# Altium schematic sheet MC1.SchDoc: XEM7360 Breakout Board - MC1
size C; Author: Nick Kettman; Organization: Opal Kelly; Address1: 13500 SW 72nd Ave Ste 100; Address2: Portland, OR 97223; Address4: http://www.opalkelly.com; DocumentNumber: xxx; Revision: 1; SheetNumber: 2; SheetTotal: 3; PageSetup: Record=PageOptions|CenterHorizontal=True|CenterVertical=True|PrintScale=0.53|XCorrection=1.00|YCorrection=1.00|PrintKind=0|BorderSize=5000000|LeftOffset=0|BottomOffset=0|Orientation=2|PaperLength=1000|PaperWidth=1000|Scale=100|PaperSource=7|PrintQuality=-4|MediaType=1|DitherType=10|PaperKind=Letter|PrintScaleMode=1
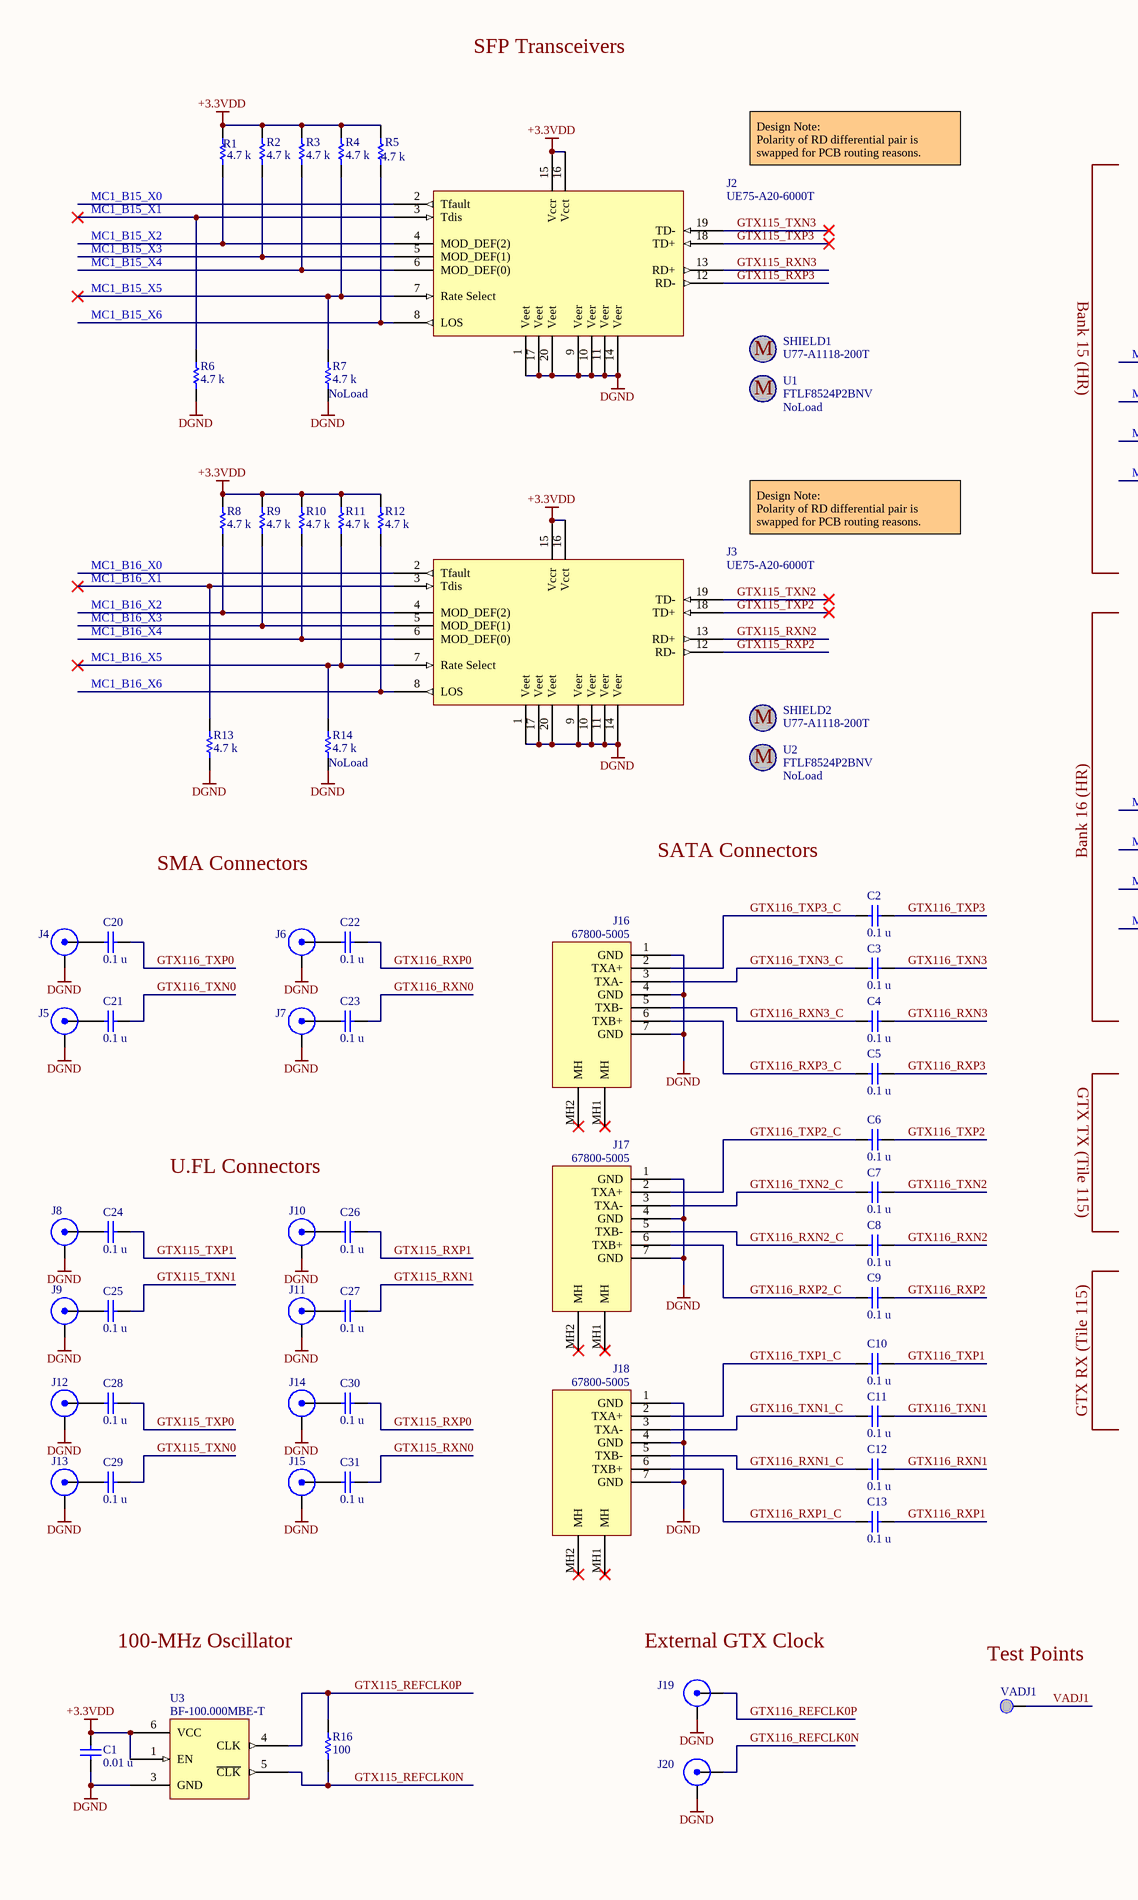
[diagram p0: MC1.SchDoc, left]
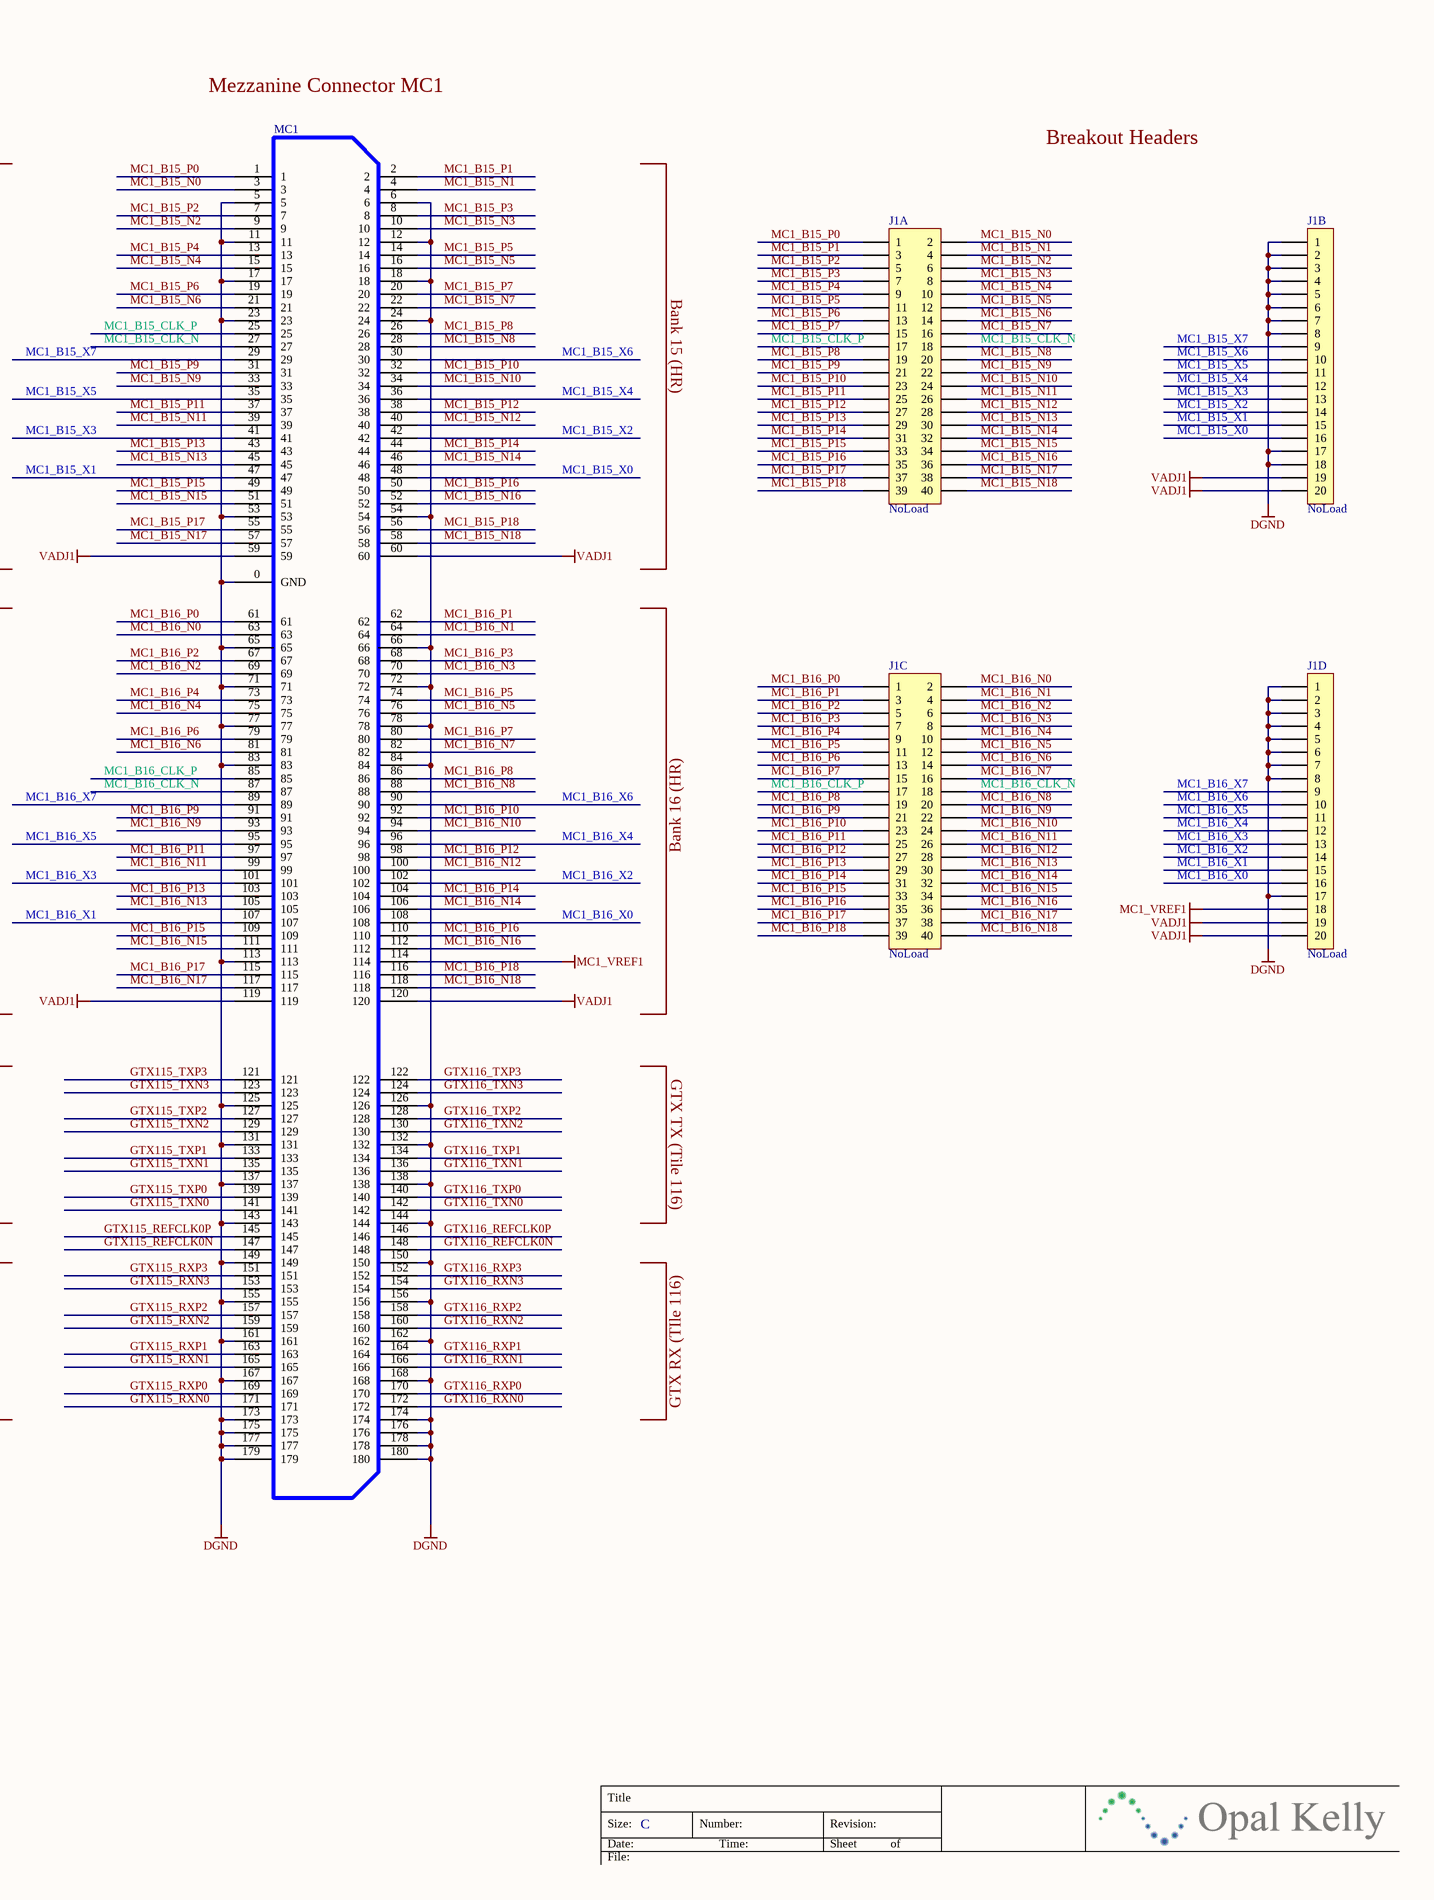
[diagram p1: MC1.SchDoc, right]

## Parts
C1  value 0.01 u  [CAPC1005N]  (hidden comment: C0402C103K4RACTU)
C2  value 0.1 u  [CAPC1005N]  (hidden comment: C0402C104K8PACTU)
C3  value 0.1 u  [CAPC1005N]  (hidden comment: C0402C104K8PACTU)
C4  value 0.1 u  [CAPC1005N]  (hidden comment: C0402C104K8PACTU)
C5  value 0.1 u  [CAPC1005N]  (hidden comment: C0402C104K8PACTU)
C6  value 0.1 u  [CAPC1005N]  (hidden comment: C0402C104K8PACTU)
C7  value 0.1 u  [CAPC1005N]  (hidden comment: C0402C104K8PACTU)
C8  value 0.1 u  [CAPC1005N]  (hidden comment: C0402C104K8PACTU)
C9  value 0.1 u  [CAPC1005N]  (hidden comment: C0402C104K8PACTU)
C10  value 0.1 u  [CAPC1005N]  (hidden comment: C0402C104K8PACTU)
C11  value 0.1 u  [CAPC1005N]  (hidden comment: C0402C104K8PACTU)
C12  value 0.1 u  [CAPC1005N]  (hidden comment: C0402C104K8PACTU)
C13  value 0.1 u  [CAPC1005N]  (hidden comment: C0402C104K8PACTU)
C20  value 0.1 u  [CAPC1005N]  (hidden comment: C0402C104K8PACTU)
C21  value 0.1 u  [CAPC1005N]  (hidden comment: C0402C104K8PACTU)
C22  value 0.1 u  [CAPC1005N]  (hidden comment: C0402C104K8PACTU)
C23  value 0.1 u  [CAPC1005N]  (hidden comment: C0402C104K8PACTU)
C24  value 0.1 u  [CAPC1005N]  (hidden comment: C0402C104K8PACTU)
C25  value 0.1 u  [CAPC1005N]  (hidden comment: C0402C104K8PACTU)
C26  value 0.1 u  [CAPC1005N]  (hidden comment: C0402C104K8PACTU)
C27  value 0.1 u  [CAPC1005N]  (hidden comment: C0402C104K8PACTU)
C28  value 0.1 u  [CAPC1005N]  (hidden comment: C0402C104K8PACTU)
C29  value 0.1 u  [CAPC1005N]  (hidden comment: C0402C104K8PACTU)
C30  value 0.1 u  [CAPC1005N]  (hidden comment: C0402C104K8PACTU)
C31  value 0.1 u  [CAPC1005N]  (hidden comment: C0402C104K8PACTU)
J1A  0877584016  [HDR2X20-2MM]  (value not drawn)
J1B  Header, 20-Pin, Single Row  [HDR1X20-2MM]  (value not drawn)
J1C  0877584016  [HDR2X20-2MM]  (value not drawn)
J1D  Header, 20-Pin, Single Row  [HDR1X20-2MM]  (value not drawn)
J2  UE75-A20-6000T  [SFP_RCPT_20_CAGE]
J3  UE75-A20-6000T  [SFP_RCPT_20_CAGE]
J4  TXP0  [SMA]  (value not drawn)
J5  TXN0  [SMA]  (value not drawn)
J6  RXP0  [SMA]  (value not drawn)
J7  RXN0  [SMA]  (value not drawn)
J8  TXP1  [UFL-R-SMT-1]  (value not drawn)
J9  TXN1  [UFL-R-SMT-1]  (value not drawn)
J10  RXP1  [UFL-R-SMT-1]  (value not drawn)
J11  RXN1  [UFL-R-SMT-1]  (value not drawn)
J12  TXP0  [UFL-R-SMT-1]  (value not drawn)
J13  TXN0  [UFL-R-SMT-1]  (value not drawn)
J14  RXP0  [UFL-R-SMT-1]  (value not drawn)
J15  RXN0  [UFL-R-SMT-1]  (value not drawn)
J16  67800-5005  [MOLEX-67800-5005]
J17  67800-5005  [MOLEX-67800-5005]
J18  67800-5005  [MOLEX-67800-5005]
J19  901-144-8RFX  [SMA]  (value not drawn)
J20  901-144-8RFX  [SMA]  (value not drawn)
MC1  QTH-090-01-F-D-A  [QTH-090-01-X-D]  (value not drawn)
R1  value 4.7 k  [RESC1005N]  (hidden comment: CRCW04024K70JNED)
R2  value 4.7 k  [RESC1005N]  (hidden comment: CRCW04024K70JNED)
R3  value 4.7 k  [RESC1005N]  (hidden comment: CRCW04024K70JNED)
R4  value 4.7 k  [RESC1005N]  (hidden comment: CRCW04024K70JNED)
R5  value 4.7 k  [RESC1005N]  (hidden comment: CRCW04024K70JNED)
R6  value 4.7 k  [RESC1005N]  (hidden comment: CRCW04024K70JNED)
R7  value 4.7 k  [RESC1005N]  (hidden comment: CRCW04024K70JNED)
R8  value 4.7 k  [RESC1005N]  (hidden comment: CRCW04024K70JNED)
R9  value 4.7 k  [RESC1005N]  (hidden comment: CRCW04024K70JNED)
R10  value 4.7 k  [RESC1005N]  (hidden comment: CRCW04024K70JNED)
R11  value 4.7 k  [RESC1005N]  (hidden comment: CRCW04024K70JNED)
R12  value 4.7 k  [RESC1005N]  (hidden comment: CRCW04024K70JNED)
R13  value 4.7 k  [RESC1005N]  (hidden comment: CRCW04024K70JNED)
R14  value 4.7 k  [RESC1005N]  (hidden comment: CRCW04024K70JNED)
R16  value 100  [RESC1608N]  (hidden comment: CRCW0603100RFKEA)
SHIELD1  U77-A1118-200T  (mechanical)
SHIELD2  U77-A1118-200T  (mechanical)
TP1  VADJ1  [TP_MED]
U1  FTLF8524P2BNV  (mechanical)
U2  FTLF8524P2BNV  (mechanical)
U3  BF-100.000MBE-T  [OSC_SMD6_5x7]

## Nets
+3.3VDD: C1.2 J2.15(Vccr) J2.16(Vcct) J3.15(Vccr) J3.16(Vcct) R1.2 R2.2 R3.2 R4.2 R5.2 R8.1 R9.1 R10.1 R11.1 R12.1 U3.1(EN) U3.6(VCC)
DGND: C1.1 J1B.1 J1B.2 J1B.3 J1B.4 J1B.5 J1B.6 J1B.7 J1B.8 J1B.17 J1B.18 J1D.1 J1D.2 J1D.3 J1D.4 J1D.5 J1D.6 J1D.7 J1D.8 J1D.17 J2.1(Veet) J2.9(Veer) J2.10(Veer) J2.11(Veer) J2.14(Veer) J2.17(Veet) J2.20(Veet) J3.1(Veet) J3.9(Veer) J3.10(Veer) J3.11(Veer) J3.14(Veer) J3.17(Veet) J3.20(Veet) J4.2(GND) J5.2(GND) J6.2(GND) J7.2(GND) J8.2(GND) J9.2(GND) J10.2(GND) J11.2(GND) J12.2(GND) J13.2(GND) J14.2(GND) J15.2(GND) J16.1(GND) J16.4(GND) J16.7(GND) J17.1(GND) J17.4(GND) J17.7(GND) J18.1(GND) J18.4(GND) J18.7(GND) J19.2(GND) J20.2(GND) MC1.0(GND) MC1.5 MC1.6 MC1.11 MC1.12 MC1.17 MC1.18 MC1.23 MC1.24 MC1.53 MC1.54 MC1.65 MC1.66 MC1.71 MC1.72 MC1.77 MC1.78 MC1.83 MC1.84 MC1.113 MC1.125 MC1.126 MC1.131 MC1.132 MC1.137 MC1.138 MC1.143 MC1.144 MC1.149 MC1.150 MC1.155 MC1.156 MC1.161 MC1.162 MC1.167 MC1.168 MC1.173 MC1.174 MC1.175 MC1.176 MC1.177 MC1.178 MC1.179 MC1.180 R6.2 R7.2 R13.2 R14.2 U3.3(GND)
MC1_VREF1: J1D.18 MC1.114
VADJ1: J1B.19 J1B.20 J1D.19 J1D.20 MC1.59 MC1.60 MC1.119 MC1.120 TP1.1(PIN)
GTX115_REFCLK0N: MC1.147 R16.1 U3.5(~{CLK})
GTX115_REFCLK0P: MC1.145 R16.2 U3.4(CLK)
GTX115_RXN0: C31.2 MC1.171
GTX115_RXN1: C27.2 MC1.165
GTX115_RXN2: J3.13(RD+) MC1.159
GTX115_RXN3: J2.13(RD+) MC1.153
GTX115_RXP0: C30.2 MC1.169
GTX115_RXP1: C26.2 MC1.163
GTX115_RXP2: J3.12(RD-) MC1.157
GTX115_RXP3: J2.12(RD-) MC1.151
GTX115_TXN0: C29.2 MC1.141
GTX115_TXN1: C25.2 MC1.135
GTX115_TXN2: J3.19(TD-) MC1.129
GTX115_TXN3: J2.19(TD-) MC1.123
GTX115_TXP0: C28.2 MC1.139
GTX115_TXP1: C24.2 MC1.133
GTX115_TXP2: J3.18(TD+) MC1.127
GTX115_TXP3: J2.18(TD+) MC1.121
GTX116_REFCLK0N: J20.1(SIGNAL) MC1.148
GTX116_REFCLK0P: J19.1(SIGNAL) MC1.146
GTX116_RXN0: C23.2 MC1.172
GTX116_RXN1: C12.2 MC1.166
GTX116_RXN1_C: C12.1 J18.5(TXB-)
GTX116_RXN2: C8.2 MC1.160
GTX116_RXN2_C: C8.1 J17.5(TXB-)
GTX116_RXN3: C4.2 MC1.154
GTX116_RXN3_C: C4.1 J16.5(TXB-)
GTX116_RXP0: C22.2 MC1.170
GTX116_RXP1: C13.2 MC1.164
GTX116_RXP1_C: C13.1 J18.6(TXB+)
GTX116_RXP2: C9.2 MC1.158
GTX116_RXP2_C: C9.1 J17.6(TXB+)
GTX116_RXP3: C5.2 MC1.152
GTX116_RXP3_C: C5.1 J16.6(TXB+)
GTX116_TXN0: C21.2 MC1.142
GTX116_TXN1: C11.2 MC1.136
GTX116_TXN1_C: C11.1 J18.3(TXA-)
GTX116_TXN2: C7.2 MC1.130
GTX116_TXN2_C: C7.1 J17.3(TXA-)
GTX116_TXN3: C3.2 MC1.124
GTX116_TXN3_C: C3.1 J16.3(TXA-)
GTX116_TXP0: C20.2 MC1.140
GTX116_TXP1: C10.2 MC1.134
GTX116_TXP1_C: C10.1 J18.2(TXA+)
GTX116_TXP2: C6.2 MC1.128
GTX116_TXP2_C: C6.1 J17.2(TXA+)
GTX116_TXP3: C2.2 MC1.122
GTX116_TXP3_C: C2.1 J16.2(TXA+)
MC1_B15_CLK_N: J1A.18 MC1.27
MC1_B15_CLK_P: J1A.17 MC1.25
MC1_B15_N0: J1A.2 MC1.3
MC1_B15_N1: J1A.4 MC1.4
MC1_B15_N2: J1A.6 MC1.9
MC1_B15_N3: J1A.8 MC1.10
MC1_B15_N4: J1A.10 MC1.15
MC1_B15_N5: J1A.12 MC1.16
MC1_B15_N6: J1A.14 MC1.21
MC1_B15_N7: J1A.16 MC1.22
MC1_B15_N8: J1A.20 MC1.28
MC1_B15_N9: J1A.22 MC1.33
MC1_B15_N10: J1A.24 MC1.34
MC1_B15_N11: J1A.26 MC1.39
MC1_B15_N12: J1A.28 MC1.40
MC1_B15_N13: J1A.30 MC1.45
MC1_B15_N14: J1A.32 MC1.46
MC1_B15_N15: J1A.34 MC1.51
MC1_B15_N16: J1A.36 MC1.52
MC1_B15_N17: J1A.38 MC1.57
MC1_B15_N18: J1A.40 MC1.58
MC1_B15_P0: J1A.1 MC1.1
MC1_B15_P1: J1A.3 MC1.2
MC1_B15_P2: J1A.5 MC1.7
MC1_B15_P3: J1A.7 MC1.8
MC1_B15_P4: J1A.9 MC1.13
MC1_B15_P5: J1A.11 MC1.14
MC1_B15_P6: J1A.13 MC1.19
MC1_B15_P7: J1A.15 MC1.20
MC1_B15_P8: J1A.19 MC1.26
MC1_B15_P9: J1A.21 MC1.31
MC1_B15_P10: J1A.23 MC1.32
MC1_B15_P11: J1A.25 MC1.37
MC1_B15_P12: J1A.27 MC1.38
MC1_B15_P13: J1A.29 MC1.43
MC1_B15_P14: J1A.31 MC1.44
MC1_B15_P15: J1A.33 MC1.49
MC1_B15_P16: J1A.35 MC1.50
MC1_B15_P17: J1A.37 MC1.55
MC1_B15_P18: J1A.39 MC1.56
MC1_B15_X0: J1B.16 J2.2(Tfault) MC1.48
MC1_B15_X1: J1B.15 J2.3(Tdis) MC1.47 R6.1
MC1_B15_X2: J1B.14 J2.4(MOD_DEF(2)) MC1.42 R1.1
MC1_B15_X3: J1B.13 J2.5(MOD_DEF(1)) MC1.41 R2.1
MC1_B15_X4: J1B.12 J2.6(MOD_DEF(0)) MC1.36 R3.1
MC1_B15_X5: J1B.11 J2.7(Rate_Select) MC1.35 R4.1 R7.1
MC1_B15_X6: J1B.10 J2.8(LOS) MC1.30 R5.1
MC1_B15_X7: J1B.9 MC1.29
MC1_B16_CLK_N: J1C.18 MC1.87
MC1_B16_CLK_P: J1C.17 MC1.85
MC1_B16_N0: J1C.2 MC1.63
MC1_B16_N1: J1C.4 MC1.64
MC1_B16_N2: J1C.6 MC1.69
MC1_B16_N3: J1C.8 MC1.70
MC1_B16_N4: J1C.10 MC1.75
MC1_B16_N5: J1C.12 MC1.76
MC1_B16_N6: J1C.14 MC1.81
MC1_B16_N7: J1C.16 MC1.82
MC1_B16_N8: J1C.20 MC1.88
MC1_B16_N9: J1C.22 MC1.93
MC1_B16_N10: J1C.24 MC1.94
MC1_B16_N11: J1C.26 MC1.99
MC1_B16_N12: J1C.28 MC1.100
MC1_B16_N13: J1C.30 MC1.105
MC1_B16_N14: J1C.32 MC1.106
MC1_B16_N15: J1C.34 MC1.111
MC1_B16_N16: J1C.36 MC1.112
MC1_B16_N17: J1C.38 MC1.117
MC1_B16_N18: J1C.40 MC1.118
MC1_B16_P0: J1C.1 MC1.61
MC1_B16_P1: J1C.3 MC1.62
MC1_B16_P2: J1C.5 MC1.67
MC1_B16_P3: J1C.7 MC1.68
MC1_B16_P4: J1C.9 MC1.73
MC1_B16_P5: J1C.11 MC1.74
MC1_B16_P6: J1C.13 MC1.79
MC1_B16_P7: J1C.15 MC1.80
MC1_B16_P8: J1C.19 MC1.86
MC1_B16_P9: J1C.21 MC1.91
MC1_B16_P10: J1C.23 MC1.92
MC1_B16_P11: J1C.25 MC1.97
MC1_B16_P12: J1C.27 MC1.98
MC1_B16_P13: J1C.29 MC1.103
MC1_B16_P14: J1C.31 MC1.104
MC1_B16_P15: J1C.33 MC1.109
MC1_B16_P16: J1C.35 MC1.110
MC1_B16_P17: J1C.37 MC1.115
MC1_B16_P18: J1C.39 MC1.116
MC1_B16_X0: J1D.16 J3.2(Tfault) MC1.108
MC1_B16_X1: J1D.15 J3.3(Tdis) MC1.107 R13.1
MC1_B16_X2: J1D.14 J3.4(MOD_DEF(2)) MC1.102 R8.2
MC1_B16_X3: J1D.13 J3.5(MOD_DEF(1)) MC1.101 R9.2
MC1_B16_X4: J1D.12 J3.6(MOD_DEF(0)) MC1.96 R10.2
MC1_B16_X5: J1D.11 J3.7(Rate_Select) MC1.95 R11.2 R14.1
MC1_B16_X6: J1D.10 J3.8(LOS) MC1.90 R12.2
MC1_B16_X7: J1D.9 MC1.89
NetC20_1: C20.1 J4.1(SIGNAL)
NetC21_1: C21.1 J5.1(SIGNAL)
NetC22_1: C22.1 J6.1(SIGNAL)
NetC23_1: C23.1 J7.1(SIGNAL)
NetC24_1: C24.1 J8.1(SIGNAL)
NetC25_1: C25.1 J9.1(SIGNAL)
NetC26_1: C26.1 J10.1(SIGNAL)
NetC27_1: C27.1 J11.1(SIGNAL)
NetC28_1: C28.1 J12.1(SIGNAL)
NetC29_1: C29.1 J13.1(SIGNAL)
NetC30_1: C30.1 J14.1(SIGNAL)
NetC31_1: C31.1 J15.1(SIGNAL)

Not connected (* = marked no-connect by the designer): J16 MH1(MH)* MH2(MH)*; J17 MH1(MH)* MH2(MH)*; J18 MH1(MH)* MH2(MH)*

## Notes on the sheet
- SFP Transceivers
- Mezzanine Connector MC1
- Design Note:
  Polarity of RD differential pair is swapped for PCB routing reasons.
- Breakout Headers
- Bank 15 (HR)
- Bank 16 (HR)
- SMA Connectors
- SATA Connectors
- GTX TX (Tile 115)
- GTX TX (Tile 116)
- U.FL Connectors
- GTX RX (Tile 115)
- GTX RX (TIle 116)
- 100-MHz Oscillator
- (near J19) External GTX Clock
- (near TP1) Test Points
- Title
- Size:
- Date:
- File:
- C
- Number:
- Time:
- Revision:
- Sheet
- of
- (in symbol 000985) M
- (in symbol 000987) M

## Library data of the parts
C1 = 000295: Ceramic Capacitor; Manufacturer: Kemet; partnumber: 000295; Description 2: SM-0402, 10%, 6.3V, X5R; ValueFloat: 1E-8; Tolerance (%): 10; Manufacturer_PN: C0402C103K4RACTU; updated_on: 2/12/2015 9:26:19 AM
C2-C13 C20-C31 = 000070: Ceramic capacitor; Manufacturer: Kemet; partnumber: 000070; Description 2: SM-0402, 10%, 10v; ValueFloat: 1E-7; Tolerance (%): 10; Manufacturer_PN: C0402C104K8PACTU; updated_on: 8/6/2015 11:41:11 AM
J1A J1C = 000583: 2mm header, 20x2, thru-hole; Manufacturer: Molex; partnumber: 000583; Manufacturer_PN: 0877584016; updated_on: 1/24/2015 12:30:40 PM; NoLoad: NoLoad
J1B J1D = 001334: 2mm header, 20x1, thru-hole; PartNumber: 001334; Manufacturer: 3M; Manufacturer_PN: 951120-8622-AR; x_lifecycle_status: Production; updated_on: 8/19/2015 3:11:41 PM; NoLoad: NoLoad
J2 J3 = 000986: SFP 20-POS Recepticle; Manufacturer: Amphenol; partnumber: 000986; Description 2: Right Angle, SMD, 15AU Gold; Manufacturer_PN: UE75-A20-6000T; updated_on: 1/24/2015 12:31:33 PM
J4-J7 = 000974: Straight SMA PCB Mount; Manufacturer: Amphenol; Manufacturer_PN: 901-144-8RFX; partnumber: 000974; updated_on: 1/24/2015 12:31:32 PM
J8-J15 = 001335: U.FL surface-mount coaxial connector; Manufacturer: Hirose; Manufacturer_PN: U.FL-R-SMT-1; partnumber: 001335; x_lifecycle_status: Production; updated_on: 8/20/2015 5:25:45 PM
J16-J18 = 000988: SATA 7-pin receptacle; Manufacturer: Molex; partnumber: 000988; Description 2: Vertical Mount, SMD, Latch, 15u Gold; x_lifecycle_status: Production; Manufacturer_PN: 67800-5005; updated_on: 3/13/2015 8:50:14 AM
J19 J20 = 000974: Straight SMA PCB Mount; Manufacturer: Amphenol; partnumber: 000974; Manufacturer_PN: 901-144-8RFX; updated_on: 1/24/2015 12:31:32 PM
MC1 = 000876: 0.5mm hi-speed, high-density header (Female); Manufacturer: Samtec; partnumber: 000876; Description 2: 180-pin, ground plane in middle; Manufacturer_PN: QTH-090-01-F-D-A; updated_on: 3/23/2015 1:16:30 PM
R1-R14 = 000754: Thick-film resistor; Manufacturer: Vishay; partnumber: 000754; Description 2: SM-0402, 5%, 1/16W; ValueFloat: 4700; Tolerance (%): 5; Manufacturer_PN: CRCW04024K70JNED; updated_on: 1/24/2015 12:31:02 PM
  R7 R14: NoLoad: NoLoad
R16 = 000789: Thick-film resistor; Manufacturer: Vishay; partnumber: 000789; Description 2: SM-0603, 1%, 1/10W; Tolerance (%): 1; Manufacturer_PN: CRCW0603100RFKEA; ValueFloat: 100; updated_on: 1/24/2015 12:31:07 PM
SHIELD1 SHIELD2 = 000987: SFP Single Cage; Manufacturer: Amphenol; partnumber: 000987; Description 2: Pressfit; x_lifecycle_status: Production; Manufacturer_PN: U77-A1118-200T; updated_on: 1/24/2015 12:31:33 PM
TP1 = 000265: Testpoint; Manufacturer: Keystone Electronics; Manufacturer_PN: 5007; partnumber: 000265; Description 2: 0.063 in. diameter, compact, White; updated_on: 1/24/2015 12:30:04 PM; NoLoad: NoLoad
U1 U2 = 000985: SFP Transceiver; Manufacturer: Finisar; partnumber: 000985; Description 2: 4.25Gb/s, Narrow Extraction Bail, Rate Selectable; Manufacturer_PN: FTLF8524P2BNV; updated_on: 8/14/2013 11:58:28 AM; NoLoad: NoLoad
U3 = 000846: 100 MHz LVDS oscillator; Manufacturer: TXC Corporation; partnumber: 000846; Description 2: 3.3v, 50ppm, industrial temp, 7mm x 5mm; Manufacturer_PN: BF-100.000MBE-T; updated_on: 10/13/2015 2:32:21 PM